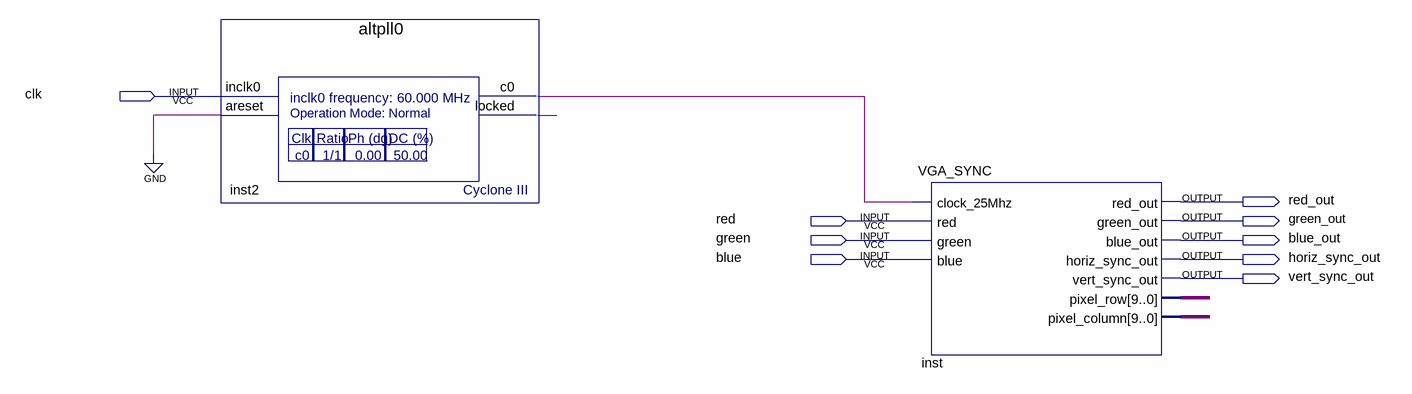
[diagram p0: schematic sheet]
// Quartus schematic Block1.bdf as structural Verilog: 2 symbols, 9 pins
module Block1 (
  input  clk,
  input  red,
  input  green,
  input  blue,
  output red_out,
  output green_out,
  output blue_out,
  output horiz_sync_out,
  output vert_sync_out
);

  wire inst2_c0, inst2_locked;
  wire [9:0] inst_pixel_column, inst_pixel_row;

  altpll0 inst2 (.inclk0(clk), .areset(1'b0), .c0(inst2_c0), .locked(inst2_locked));
  VGA_SYNC inst (
    .clock_25Mhz(inst2_c0), .red(red), .green(green), .blue(blue), .red_out(red_out), .green_out(green_out),
    .blue_out(blue_out), .horiz_sync_out(horiz_sync_out), .vert_sync_out(vert_sync_out),
    .pixel_row(inst_pixel_row), .pixel_column(inst_pixel_column));
endmodule
